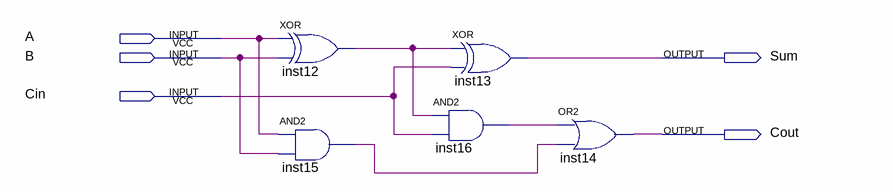
[diagram p0: schematic sheet]
// Quartus schematic fulladder.bdf as structural Verilog: 5 symbols, 5 pins
module fulladder (
  input  A,
  input  B,
  input  Cin,
  output Sum,
  output Cout
);

  wire inst12_out, inst15_out, inst16_out;

  xor inst12 (inst12_out, A, B);
  and inst15 (inst15_out, A, B);
  xor inst13 (Sum, inst12_out, Cin);
  and inst16 (inst16_out, inst12_out, Cin);
  or inst14 (Cout, inst16_out, inst15_out);
endmodule
